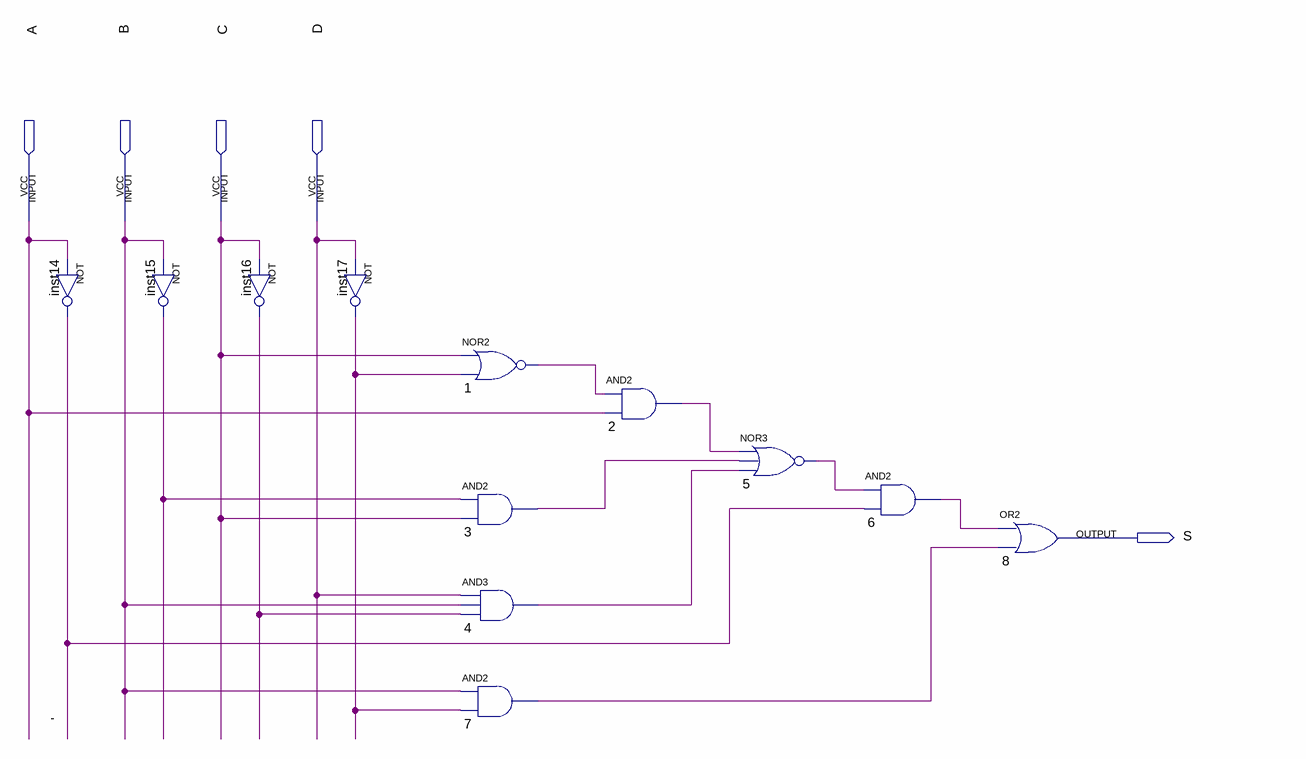
[diagram p0: schematic sheet]
// Quartus schematic Block2.bdf as structural Verilog: 12 symbols, 5 pins
module Block2 (
  input  A,
  input  B,
  input  C,
  input  D,
  output S
);

  wire \' , inst15_out, inst16_out, inst17_out, n1_out, n2_out, n3_out, n4_out, n5_out, n6_out, n7_out;

  not inst14 (\' , A);
  not inst15 (inst15_out, B);
  not inst16 (inst16_out, C);
  not inst17 (inst17_out, D);
  nor u_1 (n1_out, C, inst17_out);
  and u_3 (n3_out, inst15_out, C);
  and u_4 (n4_out, D, B, inst16_out);
  and u_7 (n7_out, B, inst17_out);
  and u_2 (n2_out, n1_out, A);
  nor u_5 (n5_out, n2_out, n3_out, n4_out);
  and u_6 (n6_out, n5_out, \' );
  or u_8 (S, n6_out, n7_out);
endmodule
